# EAGLE design FEU3 (EAGLE 6.1)
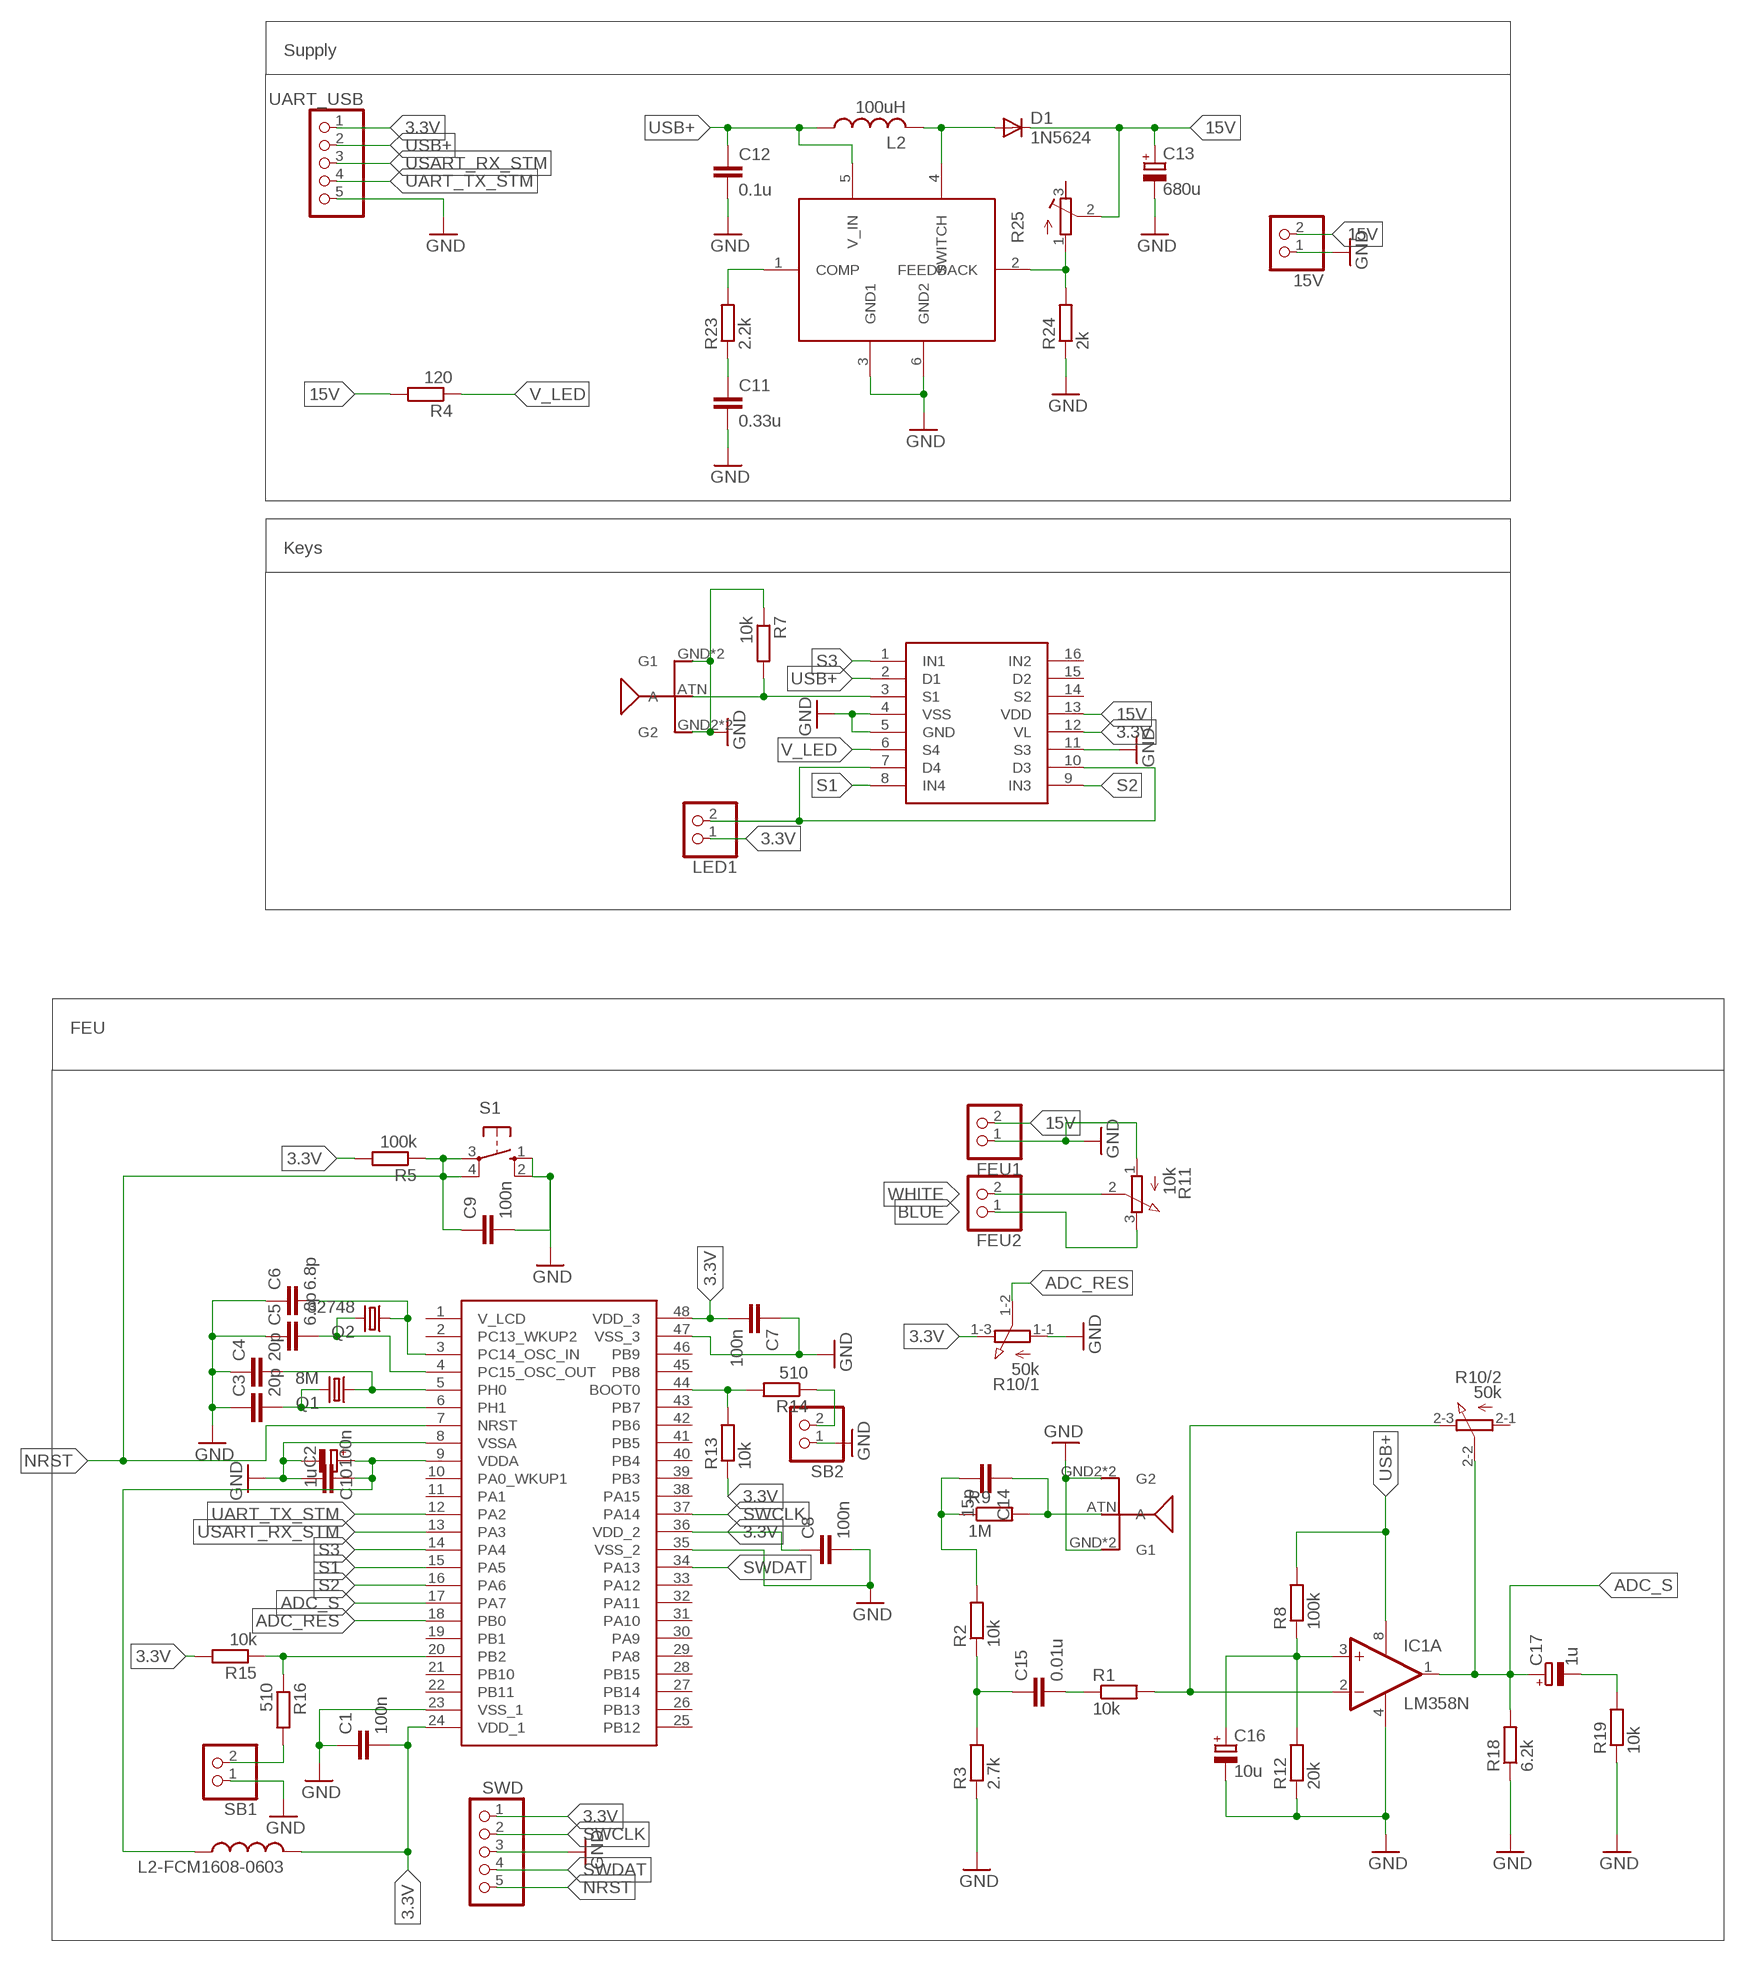
[diagram p0: schematic, sheet 1]

## Parts
15V  PINHD-1X2  [1X02]
C1  100n  C-EUC0805  [C0805]
C2  100n  C-EUC0805  [C0805]
C3  20p  C-EUC0805  [C0805]
C4  20p  C-EUC0805  [C0805]
C5  6.8p  C-EUC0805  [C0805]
C6  6.8p  C-EUC0805  [C0805]
C7  100n  C-EUC0805  [C0805]
C8  100n  C-EUC0805  [C0805]
C9  100n  C-EUC0805  [C0805]
C10  1u  CPOL-EUA/3216-18W  [A/3216-18W]
C11  0.33u  C-EUC0805  [C0805]
C12  0.1u  C-EUC0805  [C0805]
C13  680u  CPOL-EUE5-5  [E5-5]
C14  15p  C-EUC0805  [C0805]
C15  0.01u  C-EUC0805  [C0805]
C16  10u  CPOL-EUE3.5-8  [E3,5-8]
C17  1u  CPOL-EUE3.5-8  [E3,5-8]
D1  1N5624  [DO201-15]
FEU1  PINHD-1X2  [1X02]
FEU2  PINHD-1X2  [1X02]
IC1  LM358N  [DIL08]
L2  100uH  L-US0207/5V  [0207/5V]
L2-FCM1608-0603  L-USL3216C  [L3216C]
LED1  PINHD-1X2  [1X02]
Q1  8M  CRYSTALHC49S  [HC49/S]
Q2  32748  CRYSTALTC26H  [TC26H]
R1  10k  R-EU_R0805  [R0805]
R2  10k  R-EU_R0805  [R0805]
R3  2.7k  R-EU_R0805  [R0805]
R4  120  R-EU_R0805  [R0805]
R5  100k  R-EU_R0805  [R0805]
R7  10k  R-EU_R0805  [R0805]
R8  100k  R-EU_R0805  [R0805]
R9  1M  R-EU_R0805  [R0805]
R10  50k  3RP/1610G  [3RP/1610G]
R11  10k  3RP/1610N  [3RP/1610N]
R12  20k  R-EU_R0805  [R0805]
R13  10k  R-EU_R0805  [R0805]
R14  510  R-EU_R0805  [R0805]
R15  10k  R-EU_M0805  [M0805]
R16  510  R-EU_R0805  [R0805]
R18  6.2k  R-EU_R0805  [R0805]
R19  10k  R-EU_R0805  [R0805]
R23  2.2k  R-EU_R0805  [R0805]
R24  2k  R-EU_R0805  [R0805]
R25  R-TRIMM3339P  [RTRIM3339P]
S1  10-XX  [B3F-10XX]
SB1  PINHD-1X2  [1X02]
SB2  PINHD-1X2  [1X02]
SWD  PINHD-1X5  [1X05]
U$1  STM32L152C6  [LQFP48]
U$2  GSM_ANT  [GSM]
U$3  GSM_ANT  [GSM]
U$4  LM2577  [TO263-5]
U$5  ADG433BN  [DIL16]
UART_USB  PINHD-1X5  [1X05]

## Nets
3.3V: C1.2 C7.2 C8.1 L2-FCM1608-0603.2 LED1.1 R5.2 R10.1-3(/1:E) R13.1 R15.2 SWD.1 U$1.24(VDD_1) U$1.36(VDD_2) U$1.48(VDD_3) U$5.12(VL) UART_USB.1
15V: 15V.2 C13.+ D1.C FEU1.2 R4.2 R25.2(S) U$5.13(VDD)
ADC_RES: R10.1-2(/1:S) U$1.18(PB0)
ADC_S: C17.+ IC1.1(A:OUT) R10.2-2(/2:S) R18.2 U$1.17(PA7)
BLUE: FEU2.1 R11.3(E)
GND: 15V.1 C1.1 C2.1 C3.1 C4.1 C5.1 C6.1 C7.1 C8.2 C9.2 C10.- C11.2 C12.2 C13.- C16.- FEU1.1 IC1.4(P:V-) R3.1 R7.1 R10.1-1(/1:A) R11.1(A) R12.1 R18.1 R19.1 R24.1 S1.1(S) S1.2(S1) SB1.1 SB2.1 SWD.3 U$1.8(VSSA) U$1.23(VSS_1) U$1.35(VSS_2) U$1.47(VSS_3) U$2.GND1(G1) U$2.GND2(G2) U$2.GND3(G2) U$2.GND(G1) U$3.GND1(G1) U$3.GND2(G2) U$3.GND3(G2) U$3.GND(G1) U$4.3(GND1) U$4.6(GND2) U$5.4(VSS) U$5.5(GND) U$5.11(S3) UART_USB.5
N$1: C4.2 Q1.1 U$1.5(PH0)
N$2: C3.2 Q1.2 U$1.6(PH1)
N$4: LED1.2 U$5.7(D4) U$5.10(D3)
N$6: C15.1 R2.1 R3.2
N$7: C14.1 R9.2 U$2.ATN(A)
N$8: C14.2 R2.2 R9.1
N$9: C15.2 R1.1
N$10: C16.+ IC1.3(A:+IN) R8.1 R12.2
N$11: IC1.2(A:-IN) R1.2 R10.2-3(/2:E)
N$13: C5.2 Q2.2 U$1.4(PC15_OSC_OUT)
N$14: C6.2 Q2.1 U$1.3(PC14_OSC_IN)
N$15: C2.2 C10.+ L2-FCM1608-0603.1 U$1.9(VDDA)
N$16: R13.2 R14.2 U$1.44(BOOT0)
N$17: R16.2 SB1.2
N$18: R14.1 SB2.2
N$19: R15.1 R16.1 U$1.20(PB2)
N$20: C17.- R19.2
N$23: R7.2 U$3.ATN(A) U$5.3(S1)
N$26: R23.2 U$4.1(COMP)
N$27: C11.1 R23.1
N$28: R24.2 R25.1(E) U$4.2(FEEDBACK)
N$31: D1.A L2.2 U$4.4(SWITCH)
NRST: C9.1 R5.1 S1.3(P) S1.4(P1) SWD.5 U$1.7(NRST)
S1: U$1.15(PA5) U$5.8(IN4)
S2: U$1.16(PA6) U$5.9(IN3)
S3: U$1.14(PA4) U$5.1(IN1)
SWCLK: SWD.2 U$1.37(PA14)
SWDAT: SWD.4 U$1.34(PA13)
UART_TX_STM: U$1.12(PA2) UART_USB.4
USART_RX_STM: U$1.13(PA3) UART_USB.3
USB+: C12.1 IC1.8(P:V+) L2.1 R8.2 U$4.5(V_IN) U$5.2(D1) UART_USB.2
V_LED: R4.1 U$5.6(S4)
WHITE: FEU2.2 R11.2(S)
Unconnected: IC1.5(B:+IN) IC1.6(B:-IN) IC1.7(B:OUT) R10.2-1(/2:A) R25.3(A) U$1.1(V_LCD) U$1.2(PC13_WKUP2) U$1.10(PA0_WKUP1) U$1.11(PA1) U$1.19(PB1) U$1.21(PB10) U$1.22(PB11) U$1.25(PB12) U$1.26(PB13) U$1.27(PB14) U$1.28(PB15) U$1.29(PA8) U$1.30(PA9) U$1.31(PA10) U$1.32(PA11) U$1.33(PA12) U$1.38(PA15) U$1.39(PB3) U$1.40(PB4) U$1.41(PB5) U$1.42(PB6) U$1.43(PB7) U$1.45(PB8) U$1.46(PB9) U$5.14(S2) U$5.15(D2) U$5.16(IN2)

## Notes on the sheet
- Supply
- Keys
- FEU

## Library data of the parts
15V FEU1 FEU2 LED1 SB1 SB2 = pinhead:PINHD-1X2: PIN HEADER
C1-C9 C11 C12 C14 C15 = resistor:C-EU: CAPACITOR, European symbol
C10 C13 C16 C17 = resistor:CPOL-EU: POLARIZED CAPACITOR, European symbol
D1 = diode:1N5624: DIODE controlled avalanche rectifier
IC1 = linear:LM358: OP AMP also LM158; LM258; LM2904 Source: http://cache.national.com/ds/LM/LM158.pdf
L2 L2-FCM1608-0603 = resistor:L-US: INDUCTOR, American symbol
Q1 = crystal:CRYSTAL: CRYSTAL; OC_FARNELL: 1667008; OC_NEWARK: unknown
Q2 = crystal:CRYSTAL: CRYSTAL; OC_FARNELL: unknown; OC_NEWARK: unknown
R1-R5 R7-R9 R12-R16 R18 R19 R23 R24 = resistor:R-EU_: RESISTOR, European symbol
R10 = pot:3RP/1610G: 16mm Potentiometer two level Source: http://www.alphapotentiometers.net/html/16mm_pot_2.html
R11 = pot:3RP/1610N: 16mm Potentiometer one level Source: http://www.alphapotentiometers.net/html/16mm_pot_2.html
R25 = resistor:R-TRIMM: Trimm resistor
S1 = switch-omron:10-XX: OMRON SWITCH; MPN: B3F-1000; OC_FARNELL: 176432; OC_NEWARK: 36M3542
SWD UART_USB = pinhead:PINHD-1X5: PIN HEADER
U$1 = STM32L152:STM32L152C6
U$2 U$3 = discrete:GSM_ANT
U$4 = LM2577:LM2577
U$5 = ADG433:ADG433BN

## Board
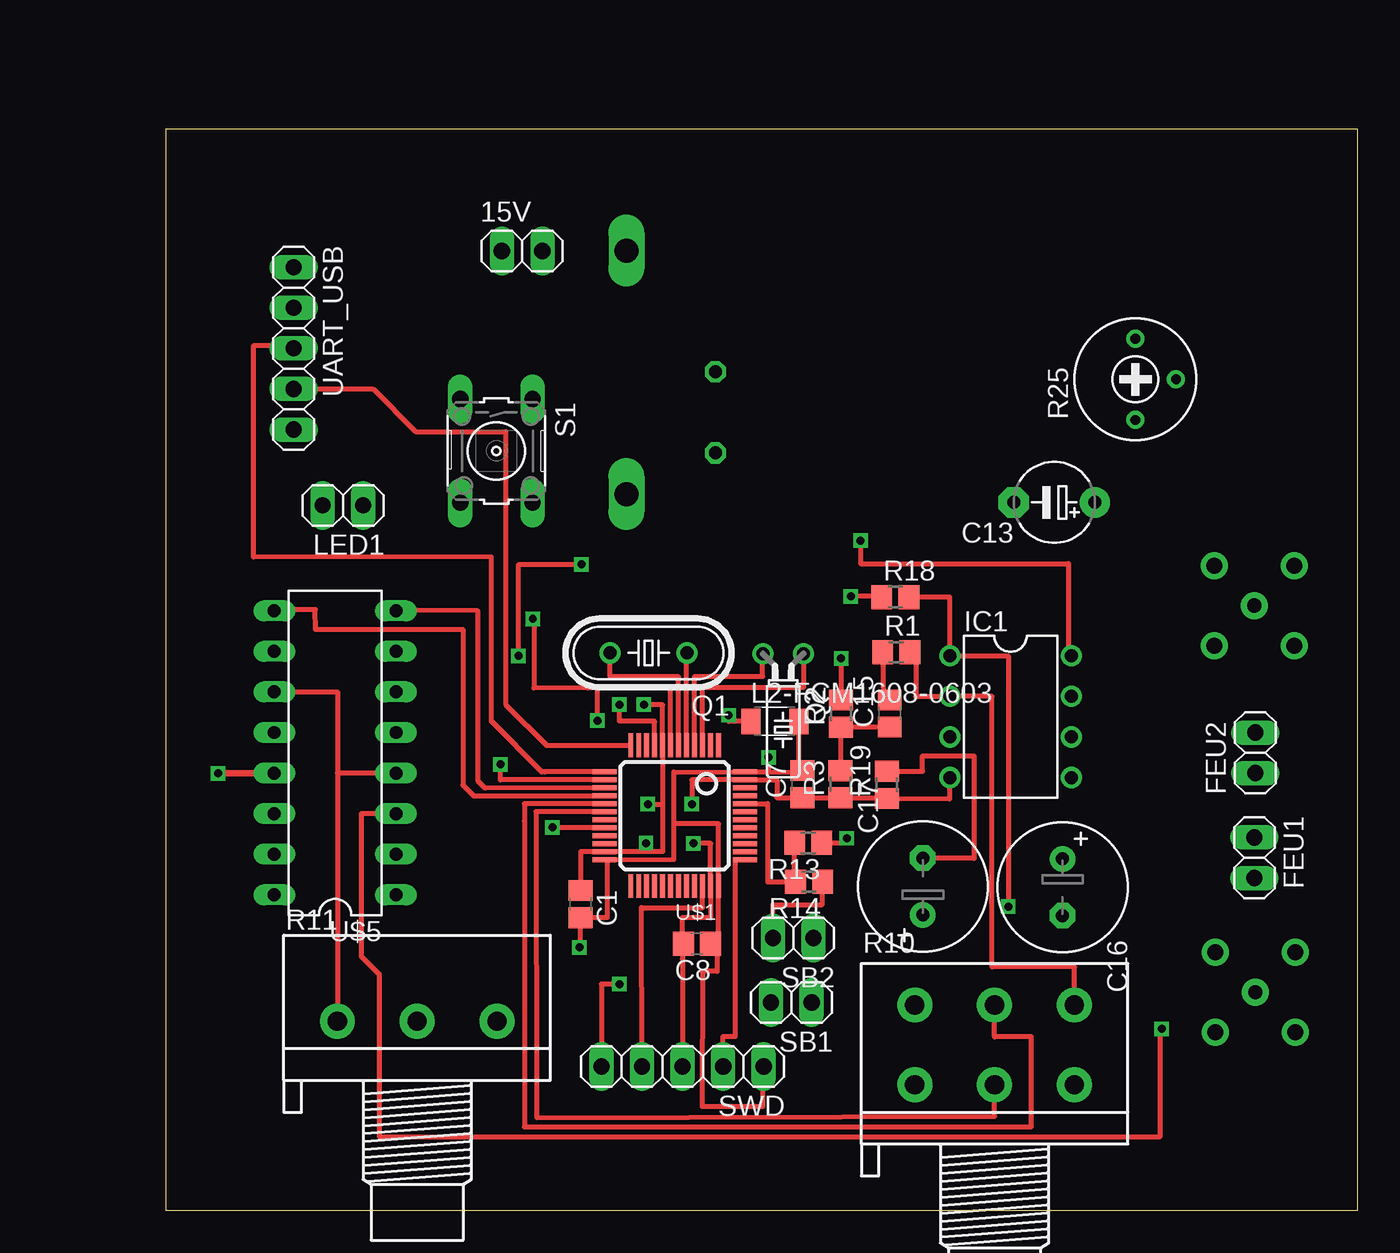
[diagram p1: board, top side]
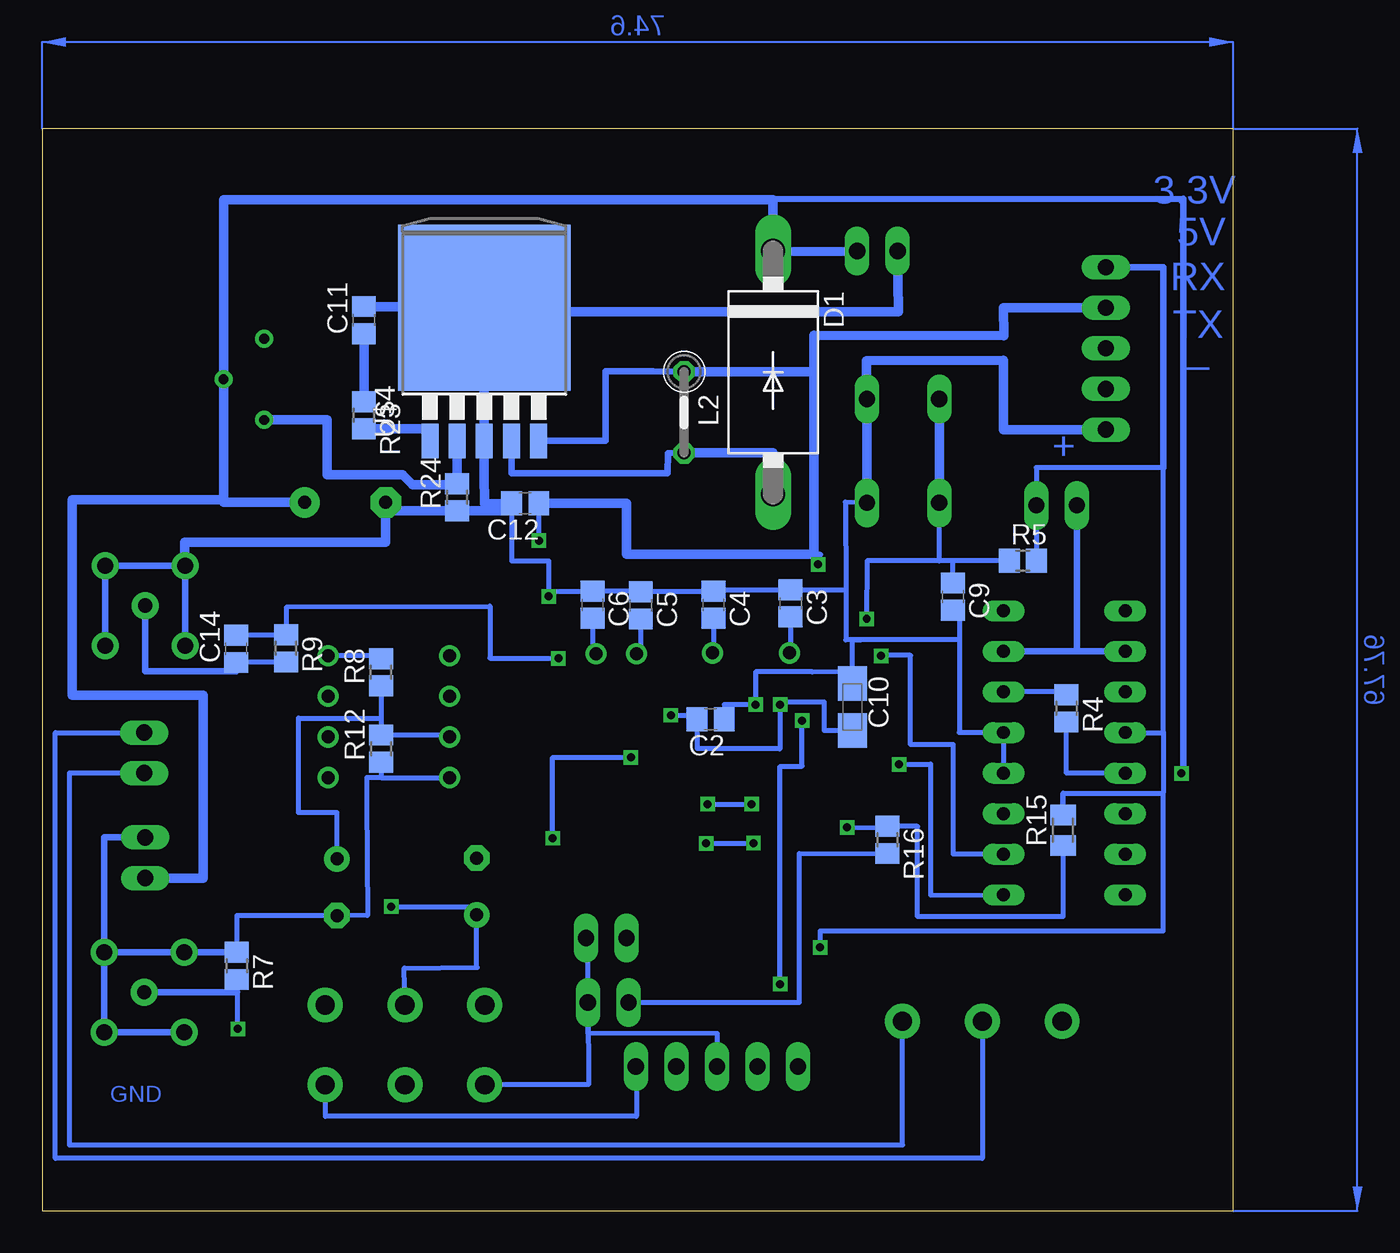
[diagram p2: board, bottom side, seen from below]

Size 74.6 x 67.76 mm. Coordinates in mm from the lower left corner, seen from the top.
Outline: 0,67.76 74.6,67.76 74.6,0 0,0 0,67.76
Copper layers (1*16): Top 0.035mm / dielectric 1.5mm / Bottom 0.035mm
Design rules: minimum track width 10mil, minimum drill 24mil, track to track 8mil, track to pad 8mil, pad to pad 8mil, via to via 8mil, smd to smd 8mil, copper to edge 40mil, drill to drill 8mil, minimum pad ring 10mil, minimum via ring 8mil, stop-mask expansion 4mil, vias tented up to drill 0mil, thermal gap 10mil

### Footprints (pad centres in the part's own frame; a part is rotated, then mirrored left to right if it is on the bottom)
1X02 = drill 1.016 long: 1 -1.27,0; 2 1.27,0
C0805 = smd 1.3 x 1.5: 1 -0.85,0; 2 0.85,0
A/3216-18W = smd 2.15 x 1.8: + 1.475,0; - -1.475,0
E5-5 = drill 0.813 pad 1.905: + -2.54,0 | drill 0.813 pad 1.905 octagon: - 2.54,0
E3,5-8 = drill 0.813 pad 1.6: + -1.778,0 | drill 0.813 pad 1.6 octagon: - 1.778,0
DO201-15 = drill 1.499 long: A 7.62,0; C -7.62,0
DIL08 = drill 0.813 pad 1.27: 1 -3.81,-3.81; 2 -1.27,-3.81; 3 1.27,-3.81; 4 3.81,-3.81; 5 3.81,3.81; 6 1.27,3.81; 7 -1.27,3.81; 8 -3.81,3.81
0207/5V = drill 0.813 octagon: 1 -2.54,0; 2 2.54,0
L3216C = smd 1.2 x 1.6: 1 -1.5,0; 2 1.5,0
HC49/S = drill 0.813: 1 -2.413,0; 2 2.413,0
TC26H = drill 0.813: 1 -1.27,0; 2 1.27,0
R0805 = smd 1.3 x 1.5: 1 -0.85,0; 2 0.85,0
3RP/1610G = drill 1.2 pad 2.184: 1-1 -5,0; 1-2 0,0; 1-3 5,0; 2-1 -5,5; 2-2 0,5; 2-3 5,5
3RP/1610N = drill 1.2 pad 2.184: 1 -5,0; 2 0,0; 3 5,0
M0805 = smd 1.3 x 1.6: 1 -0.95,0; 2 0.95,0
RTRIM3339P = drill 0.61: 1 -2.54,0; 2 0,-2.54; 3 2.54,0
B3F-10XX = drill 1.016 long: 1 -3.251,2.261; 2 3.251,2.261; 3 -3.251,-2.261; 4 3.251,-2.261
1X05 = drill 1.016 long: 1 -5.08,0; 2 -2.54,0; 3 0,0; 4 2.54,0; 5 5.08,0
LQFP48 = smd 0.3 x 1.5: 1 -2.75,-4.4; 2 -2.25,-4.4; 3 -1.75,-4.4; 4 -1.25,-4.4; 5 -0.75,-4.4; 6 -0.25,-4.4; 7 0.25,-4.4; 8 0.75,-4.4; 9 1.25,-4.4; 10 1.75,-4.4; 11 2.25,-4.4; 12 2.75,-4.4; 25 2.75,4.4; 26 2.25,4.4; 27 1.75,4.4; 28 1.25,4.4; 29 0.75,4.4; 30 0.25,4.4; 31 -0.25,4.4; 32 -0.75,4.4; 33 -1.25,4.4; 34 -1.75,4.4; 35 -2.25,4.4; 36 -2.75,4.4 | smd 1.5 x 0.3: 13 4.4,-2.75; 14 4.4,-2.25; 15 4.4,-1.75; 16 4.4,-1.25; 17 4.4,-0.75; 18 4.4,-0.25; 19 4.4,0.25; 20 4.4,0.75; 21 4.4,1.25; 22 4.4,1.75; 23 4.4,2.25; 24 4.4,2.75; 37 -4.4,2.75; 38 -4.4,2.25; 39 -4.4,1.75; 40 -4.4,1.25; 41 -4.4,0.75; 42 -4.4,0.25; 43 -4.4,-0.25; 44 -4.4,-0.75; 45 -4.4,-1.25; 46 -4.4,-1.75; 47 -4.4,-2.25; 48 -4.4,-2.75
GSM = drill 0.9 pad 1.676: ATN 0,0 | drill 1 pad 1.676: GND -2.5,2.5; GND1 -2.5,-2.5; GND2 2.5,-2.5; GND3 2.5,2.5
TO263-5 = smd 1.067 x 2.159: 1 -3.404,-7.061; 2 -1.702,-7.061; 3 0,-7.061; 4 1.702,-7.061; 5 3.404,-7.061 | smd 10.8 x 10.41: 6 0,1.27
DIL16 = drill 0.813 long: 1 -7.62,-3.81; 2 -5.08,-3.81; 3 -2.54,-3.81; 4 0,-3.81; 5 2.54,-3.81; 6 5.08,-3.81; 7 7.62,-3.81; 8 10.16,-3.81; 9 10.16,3.81; 10 7.62,3.81; 11 5.08,3.81; 12 2.54,3.81; 13 0,3.81; 14 -2.54,3.81; 15 -5.08,3.81; 16 -7.62,3.81

### Placement (x,y rotation side)
15V  22.28,60.09 0 top
C1  25.94,19.21 270 top
C2  32.72,30.79 180 bottom
C3  27.71,38.04 270 bottom
C4  32.54,37.95 270 bottom
C5  37.1,37.91 270 bottom
C6  40.13,37.95 270 bottom
C7  39.83,26.72 90 top
C8  33.23,16.72 180 top
C9  17.55,38.46 270 bottom
C10  23.84,31.54 270 bottom
C11  54.44,55.77 90 bottom
C12  44.34,44.3 180 bottom
C13  55.61,44.36 180 top
C14  62.43,35.19 90 bottom
C15  45.3,31.14 90 top
C16  56.13,20.26 270 top
C17  47.38,20.31 90 top
D1  28.81,52.5 270 bottom
FEU1  68.14,22.11 270 top
FEU2  68.2,28.68 90 top
IC1  52.87,30.94 270 top
L2  34.38,49.99 270 bottom
L2-FCM1608-0603  38.11,30.65 0 top
LED1  11.06,44.17 180 top
Q1  30.2,34.93 180 top
Q2  38.63,34.88 180 top
R1  45.71,34.98 0 top
R2  42.25,31.13 90 top
R3  42.22,26.71 90 top
R4  10.43,31.46 270 bottom
R5  13.17,40.7 0 bottom
R7  62.4,15.34 270 bottom
R8  53.37,33.72 90 bottom
R9  59.32,35.22 270 bottom
R10  51.87,7.89 0 top
R11  15.71,11.87 0 top
R12  53.36,28.94 90 bottom
R13  40.2,23.04 180 top
R14  40.25,20.6 180 top
R15  10.66,23.83 90 bottom
R16  21.65,23.23 270 bottom
R18  45.65,38.43 0 top
R19  45.12,26.67 90 top
R23  54.44,49.81 270 bottom
R24  48.6,44.68 90 bottom
R25  60.69,52.06 90 top
S1  20.67,47.58 270 top
SB1  39.14,13.05 180 top
SB2  39.26,17.08 180 top
SWD  32.33,9.04 180 top
U$1  31.83,24.74 180 top
U$2  68.14,37.89 0 top
U$3  68.2,13.69 270 top
U$4  46.9,55.27 0 bottom
U$5  10.57,27.41 90 top
UART_USB  7.97,54 270 top

### Tracks (layer width: path | path; a pad name or v marks a point on that pad's centre or on a via)
3.3V  (via drill 0.5)
  Top 0.305: 37.55,27.49 37.41,27.49 U$1.48 31.78,27.47 31.78,24.23 | 37.55,27.49 39.53,27.47 | 39.53,27.47 C7.2 | 31.78,24.23 34.58,24.23 U$1.36 34.58,16.06 C8.1 34.31,16.17 34.5,16.2 34.5,15 33.57,15 33.55,6.55 37.36,6.55 37.36,8.49 SWD.1 | 31.78,24.23 31.78,22 U$1.24 27.6,21.99 27.6,18.36 C1.2 25.94,16.5 v25.87,16.5 | 39.53,27.47 39.61,27.47 L2-FCM1608-0603.2 | R13.1 42.62,23.04 v42.62,23.33 | v37.72,28.39 37.72,27.49 37.55,27.49
  Bottom 0.305: v42.62,23.33 42.62,28.39 v37.72,28.39 | SWD.1 37.37,5.92 56.85,5.92 56.85,8.06 R10.1-3 | 10.66,26.12 R15.2 10.66,26.16 4.39,26.16 | 4.39,26.16 4.39,17.51 25.87,17.51 v25.87,16.5 | R5.2 12.33,41.94 LED1.1 12.33,46.53 4.37,46.53 4.37,29.95 U$5.12 4.38,29.94 4.38,26.17 arc-90 4.39,26.16
  Bottom 0.406: UART_USB.1 4.37,59.08 4.37,46.53
15V  (via drill 0.5)
  Top 0.406: v3.24,27.39 4.22,27.41 U$5.13
  Bottom 0.305: U$5.13 8.11,27.41 9.45,27.4 10.43,27.4 R4.2
  Bottom 0.406: D1.C 28.81,63.33 3.13,63.38 3.13,27.41 v3.24,27.39
  Bottom 0.61: C13.+ 63.23,44.36 63.23,44.53 | 63.23,44.53 R25.2 63.23,63.3 28.81,63.3 D1.C 28.75,60.06 15V.2 | FEU1.2 64.49,20.84 64.49,32.27 72.7,32.27 72.7,44.53 63.23,44.53
ADC_RES
  Top 0.305: U$1.18 23.15,24.99 23.2,5.84 51.86,5.91 R10.1-2
ADC_S  (via drill 0.5)
  Top 0.305: R18.2 49.06,38.43 IC1.1 52.72,34.75 v52.72,19.05 | U$1.17 22.42,25.49 22.42,24.4 22.43,24.4 22.43,5.26 54.16,5.26 54.16,10.91 51.86,10.9 R10.2-2
  Bottom 0.305: R10.2-2 51.91,15.2 47.34,15.24 47.38,15.24 C17.+ 47.38,19.05 v52.72,19.05
BLUE
  Bottom 0.305: FEU2.1 72.88,27.41 72.88,4.13 20.71,4.13 R11.3
GND  (via drill 0.5)
  Top 0.305: C1.1 25.95,22.49 U$1.23 30.04,22.49 | 31.08,25.45 U$1.8 31.08,31.68 v29.9,31.69 | 31.08,25.45 31.08,22.49 30.04,22.49 | v32.91,25.46 32.91,26.99 U$1.47 37.86,26.98 38.24,26.97 38.24,25.87 C7.1 R3.1 45.12,25.86 R19.1 49.07,25.8 IC1.4 | v30.16,25.46 31.08,25.45 | v33.01,23.01 34.08,23.01 U$1.35 34.08,18.35 32.28,18.35 32.28,16.59 32.32,15.77 | v30.04,23.03 30.04,22.49 | C8.2 32.32,15.77 | 32.32,15.77 SWD.3 | R18.1 44.8,38.47 v42.87,38.47 | U$5.4 10.71,27.41 | 10.71,27.41 R11.1 | U$5.11 10.71,32.49 10.71,27.41
  Bottom 0.305: v32.91,25.46 v30.16,25.46 | v33.01,23.01 33.01,23.03 v30.04,23.03 | C2.1 31.87,31.69 v29.9,31.69 29.9,33.74 26.36,33.74 23.89,33.73 C10.- 23.84,35.73 23.34,35.75 | 24.26,38.89 C3.1 32.54,38.89 C4.1 32.54,38.76 C5.1 37.1,38.8 C6.1 42.87,38.8 v42.87,38.47 42.87,40.7 45.19,40.7 45.19,43.83 | 24.26,38.89 24.26,35.75 23.34,35.75 | SB1.1 40.39,17.12 SB2.1 | SB1.1 40.38,7.91 R10.1-1 | SB1.1 40.42,11.15 32.32,11.11 32.32,9.46 SWD.3 | R12.1 53.36,27.13 | 53.36,27.13 IC1.4 | U$5.4 U$5.5 17.15,29.95 17.15,35.75 | 17.15,35.75 23.34,35.75 | S1.2 24.29,44.38 24.26,38.89 | R7.1 62.4,18.48 C16.- 54.22,18.5 54.26,25.61 54.26,27.13 53.36,27.13 | C9.2 17.15,37.61 17.15,35.75
  Bottom 0.406: U$3.GND U$3.GND3 U$3.GND2 | U$2.GND2 U$2.GND3 U$2.GND U$2.GND1 | U$3.GND U$3.GND1 R7.1 | FEU1.1 70.7,23.38 U$3.GND
  Bottom 0.61: C11.2 46.9,56.62 U$4.6 | U$4.6 U$4.3 46.9,46.12 46.89,44.28 C12.2 45.19,43.83 R24.1 53.07,43.83 C13.- 53.07,41.86 65.65,41.86 U$2.GND | S1.2 S1.1 22.96,53.23 14.4,53.27 14.38,48.92 UART_USB.5 | 45.89,57.55 46.38,57.06 | 46.38,57.06 U$4.6 | 15V.1 20.97,56.28 45.56,56.28 45.56,57.06 46.38,57.06
N$1
  Top 0.305: U$1.5 32.58,34.93 Q1.1
  Bottom 0.305: C4.2 32.54,34.93 Q1.1
N$2
  Top 0.305: U$1.6 32.08,33.44 27.79,33.44 Q1.2
  Bottom 0.305: C3.2 27.71,34.93 Q1.2
N$4
  Bottom 0.406: 9.79,44.19 LED1.2 9.79,35.06 U$5.10 7.6,35.03 10.09,35.05 14.34,35.05 14.2,35.21 U$5.7
N$6
  Top 0.305: R3.2 42.22,30.28 R2.1 C15.1
N$7
  Bottom 0.305: C14.1 62.43,34.37 R9.2
  Bottom 0.406: U$2.ATN 68.14,33.8 62.44,33.8 C14.1
N$8  (via drill 0.5)
  Top 0.305: v42.25,34.59 R2.2
  Bottom 0.305: v42.25,34.59 42.25,34.61 46.55,34.61 46.55,37.86 59.27,37.82 59.27,36.07 R9.1 59.32,36.04 C14.2
N$9
  Top 0.305: R1.1 44.9,31.99 C15.2
N$10
  Bottom 0.305: IC1.3 49.06,29.79 R12.2 53.37,30.85 | R8.1 53.37,30.85 | C16.+ 56.13,24.94 58.53,24.94 58.53,30.85 53.37,30.85
N$11
  Top 0.305: R1.2 46.93,34.98 46.93,32.21 IC1.2 51.71,32.21 51.71,15.27 56.87,15.26 R10.2-3
N$13
  Top 0.305: U$1.4 33.08,33.46 37.34,33.46 37.34,34.88 Q2.2
  Bottom 0.305: C5.2 37.1,34.88 Q2.2
N$14
  Top 0.305: U$1.3 33.58,32.77 39.92,32.79 39.92,34.9 Q2.1
  Bottom 0.305: C6.2 40.13,34.88 Q2.1
N$15  (via drill 0.5)
  Top 0.305: U$1.9 30.58,30.62 30.57,30.66 28.38,30.66 v28.38,31.69 | L2-FCM1608-0603.1 35.21,30.65 v35.21,31.03
  Bottom 0.305: 33.57,31.02 33.56,28.94 28.39,28.93 v28.38,31.69 28.37,31.86 28.11,31.85 25.6,31.85 25.6,30.06 25.36,30.06 C10.+ | v35.21,31.03 33.57,31.02 | 33.57,31.02 C2.2
N$16
  Top 0.305: U$1.44 37.65,25.49 37.65,20.6 R14.2 39.34,20.64 R13.2
N$17
  Bottom 0.305: SB1.2 27.17,13.05 27.17,22.37 R16.2
N$18
  Top 0.305: SB2.2 37.99,19.17 41.09,19.17 R14.1
N$19  (via drill 0.5)
  Top 0.305: U$1.20 24.18,23.99 v24.18,24.01
  Bottom 0.305: v24.18,24.01 21.66,23.98 R16.1 19.77,24.08 19.77,18.42 10.65,18.42 R15.1
N$20
  Top 0.305: R19.2 47.36,27.52 47.36,28.48 50.58,28.48 50.58,22.07 47.38,22.07 C17.-
N$23  (via drill 0.5)
  Top 0.305: U$5.3 12.2,24.87 12.2,15.93 13.33,14.8 13.33,4.65 62.24,4.65 62.24,11.39 v62.33,11.39
  Bottom 0.305: v62.33,11.39 62.33,13.69 62.61,13.69
  Bottom 0.406: U$3.ATN 62.61,13.69 62.4,13.69 R7.2
N$26
  Bottom 0.61: R23.2 50.3,48.96 U$4.1
N$27
  Bottom 0.61: C11.1 R23.1
N$28
  Bottom 0.61: U$4.2 R24.2 48.68,45.45 51.39,45.45 52.03,46.09 56.73,46.09 56.73,49.52 R25.1
N$31
  Bottom 0.406: L2.2 35.39,47.42 35.41,46.17 45.2,46.17 U$4.4
  Bottom 0.61: D1.A 28.81,47.45 L2.2
NRST  (via drill 0.5)
  Top 0.305: U$1.7 31.58,32.72 27.39,32.75 26.4,32.75 | 26.4,32.75 23.02,32.73 23.02,37.07 v22.95,37.07 | v28.38,14.2 27.25,14.2 SWD.5 | v27,30.69 26.99,32.74 26.4,32.75
  Bottom 0.305: S1.4 18.41,40.7 R5.1 17.55,40.7 | 17.55,40.7 22.93,40.7 v22.95,37.07 | v28.38,14.2 28.38,27.83 27,27.84 v27,30.69 | C9.1 17.55,40.7
  Bottom 0.61: S1.4 S1.3
S1
  Top 0.305: U$1.15 19.97,26.47 19.5,26.94 19.5,37.56 14.38,37.6 U$5.8
S2
  Top 0.305: U$5.9 6.76,37.65 9.33,37.65 9.34,36.39 18.58,36.39 18.58,26.66 19.25,25.99 U$1.16
S3  (via drill 0.5)
  Top 0.305: U$1.14 20.93,26.99 v20.92,27.95
  Bottom 0.305: v20.92,27.95 18.95,27.97 18.95,19.79 14.38,19.77 U$5.1
SWCLK
  Top 0.305: SWD.2 34.87,10.93 35.64,10.93 35.64,21.95 U$1.37
SWDAT
  Top 0.305: SWD.4 29.75,18.99 33.59,18.99 U$1.34
UART_TX_STM
  Top 0.305: UART_USB.4 12.94,51.46 15.62,48.78 21.25,48.78 21.25,31.7 23.81,29.14 U$1.12
USART_RX_STM
  Top 0.305: U$1.13 23.69,27.49 23.51,27.49 20.36,30.64 20.36,40.93 5.46,40.95 5.48,54.18 8.14,54.18 UART_USB.3
USB+  (via drill 0.5)
  Top 0.305: v43.47,41.96 43.47,40.53 56.5,40.53 56.5,34.75 IC1.8 | v22.05,34.75 22.06,40.48 v25.99,40.48
  Bottom 0.305: R8.2 53.37,34.75 IC1.8 | C12.1 43.49,41.96 v43.47,41.96 | U$5.2 17.53,22.33 17.53,29.19 20.21,29.19 20.21,34.78 21.7,34.78 v22.05,34.75 | v25.99,40.48 25.84,41.1 26.24,41.1
  Bottom 0.406: U$4.5 39.31,48.21 39.31,52.58 36.34,52.56 L2.1
  Bottom 0.61: U$4.5 | L2.1 26.24,52.53 | 26.24,52.53 26.24,41.1 37.98,41.1 37.98,44.3 C12.1 | UART_USB.2 14.39,56.54 14.37,54.79 26.25,54.81 26.24,52.53
V_LED
  Bottom 0.305: R4.1 arc90 10.39,32.49 U$5.6
WHITE
  Bottom 0.305: R11.2 15.71,3.29 73.76,3.29 73.76,29.95 FEU2.2
(copper drawn outside any net)
  shapes: Bottom area x2

### Text on the board
Bottom: 3.3V | 5V | RX | TX | _ | + | GND | +